# Altium schematic sheet Sheet_1_2022-01-13.schdoc
size 57 x 37 mm
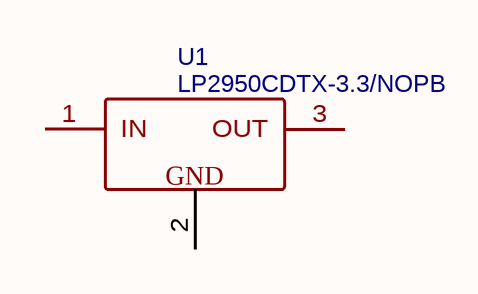
[diagram p0: Sheet_1_2022-01-13.schdoc]

## Parts
U1  LP2950CDTX-3.3/NOPB  [TO-252-2_L6.6-W6.1-P4.57-LS9.9-BR-CW]

## Nets

Not connected (* = marked no-connect by the designer): U1 1(IN) 2(GND) 3(OUT)

## Library data of the parts
U1 = LP2950CDTX-3.3/NOPB: BOM_Manufacturer: TI; Contributor: LCSC; BOM_Supplier: LCSC; BOM_Manufacturer Part: LP2950CDTX-3.3/NOPB; BOM_Supplier Part: C129994; BOM_JLCPCB Part Class: Extended Part; spicePre: U; spiceSymbolName: LP2950CDTX-3.3/NOPB